# Altium schematic sheet Power.SchDoc
size 437 x 311 mm; TypeSCHEM: принципиальная; DocumentNumber1: Э3
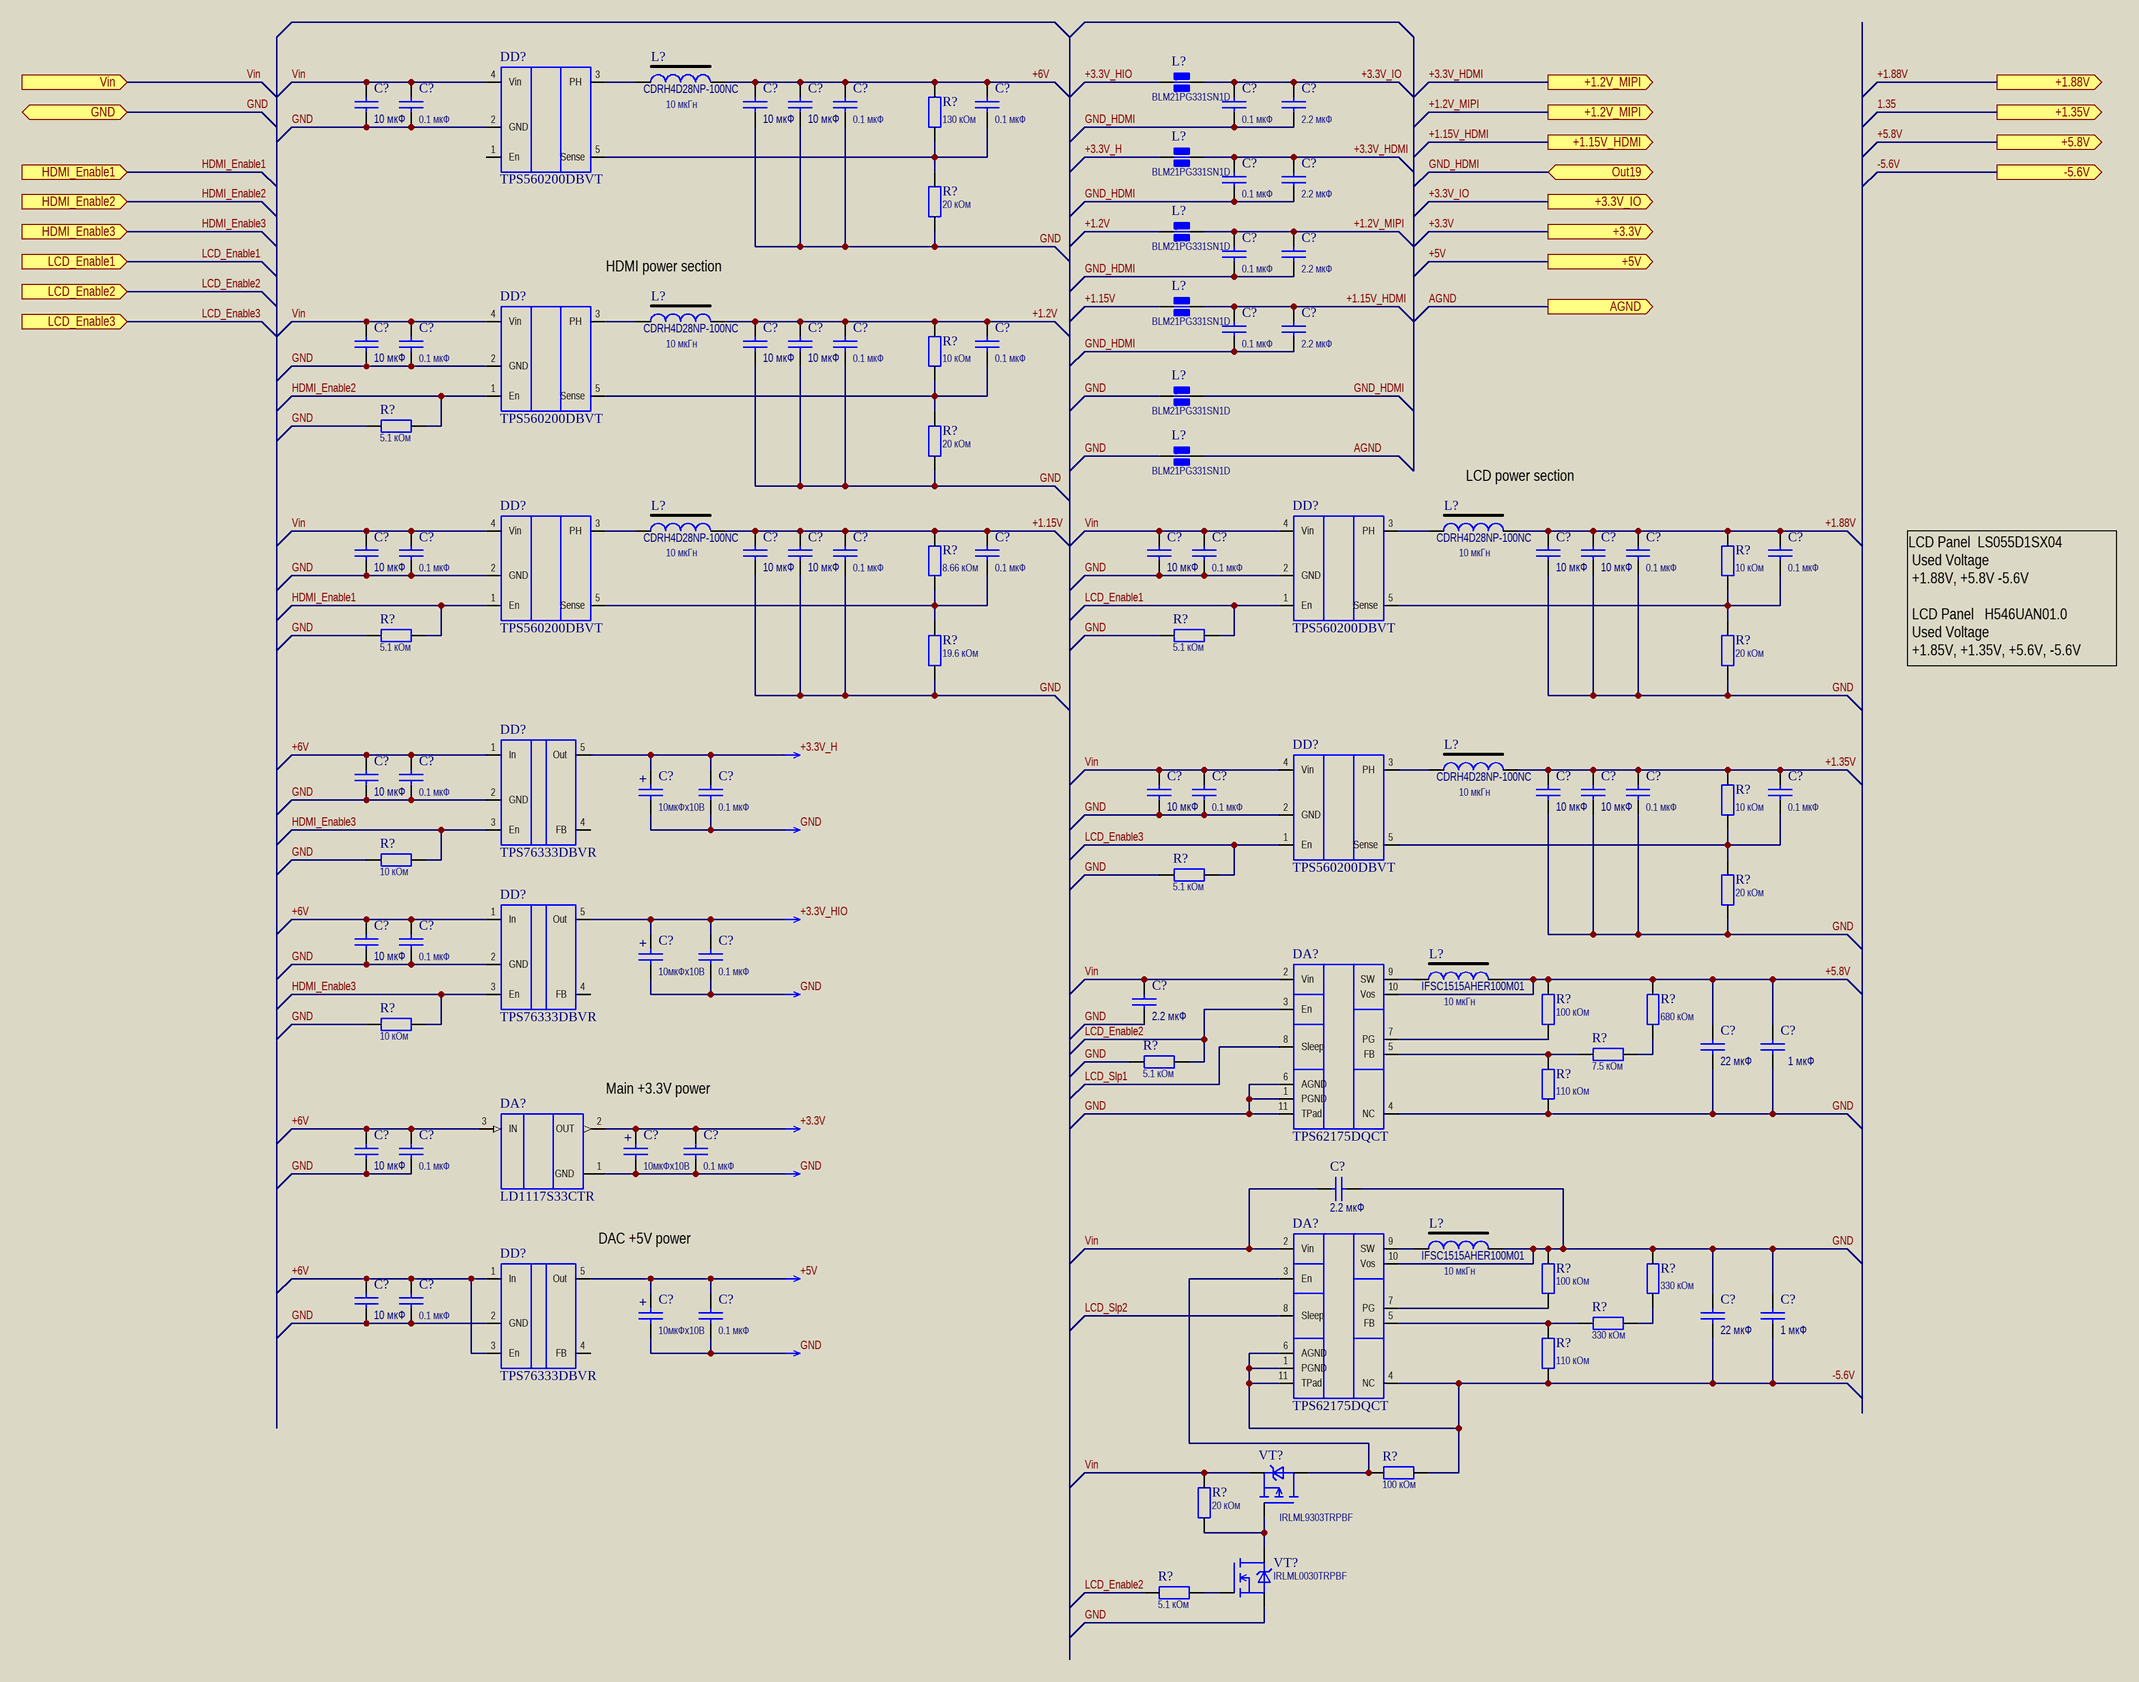
[diagram p0: Power.SchDoc]

## Parts
(Parts that share a designator on the sheet are numbered #1, #2 ... from top to bottom, then left to right.)
C?#1  10 мкФ  [Chip1210]
C?#2  value 0.1 мкФ  [Chip0603]  (hidden comment: C)
C?#3  10 мкФ  [Chip1210]
C?#4  10 мкФ  [Chip1210]
C?#5  value 0.1 мкФ  [Chip0603]  (hidden comment: C)
C?#6  value 0.1 мкФ  [Chip0603]  (hidden comment: C)
C?#7  value 0.1 мкФ  [Chip0603]  (hidden comment: C)
C?#8  value 2.2 мкФ  [Chip0603]  (hidden comment: C)
C?#9  value 0.1 мкФ  [Chip0603]  (hidden comment: C)
C?#10  value 2.2 мкФ  [Chip0603]  (hidden comment: C)
C?#11  value 0.1 мкФ  [Chip0603]  (hidden comment: C)
C?#12  value 2.2 мкФ  [Chip0603]  (hidden comment: C)
C?#13  value 0.1 мкФ  [Chip0603]  (hidden comment: C)
C?#14  value 2.2 мкФ  [Chip0603]  (hidden comment: C)
C?#15  10 мкФ  [Chip1210]
C?#16  value 0.1 мкФ  [Chip0603]  (hidden comment: C)
C?#17  10 мкФ  [Chip1210]
C?#18  10 мкФ  [Chip1210]
C?#19  value 0.1 мкФ  [Chip0603]  (hidden comment: C)
C?#20  value 0.1 мкФ  [Chip0603]  (hidden comment: C)
C?#21  10 мкФ  [Chip1210]
C?#22  value 0.1 мкФ  [Chip0603]  (hidden comment: C)
C?#23  10 мкФ  [Chip1210]
C?#24  10 мкФ  [Chip1210]
C?#25  value 0.1 мкФ  [Chip0603]  (hidden comment: C)
C?#26  value 0.1 мкФ  [Chip0603]  (hidden comment: C)
C?#27  10 мкФ  [Chip1210]
C?#28  value 0.1 мкФ  [Chip0603]  (hidden comment: C)
C?#29  10 мкФ  [Chip1210]
C?#30  10 мкФ  [Chip1210]
C?#31  value 0.1 мкФ  [Chip0603]  (hidden comment: C)
C?#32  value 0.1 мкФ  [Chip0603]  (hidden comment: C)
C?#33  10 мкФ  [Chip1210]
C?#34  value 0.1 мкФ  [Chip0603]  (hidden comment: C)
C?#35  value 10мкФx10В  [ChipA]  (hidden comment: CP)
C?#36  value 0.1 мкФ  [Chip0603]  (hidden comment: C)
C?#37  10 мкФ  [Chip1210]
C?#38  value 0.1 мкФ  [Chip0603]  (hidden comment: C)
C?#39  10 мкФ  [Chip1210]
C?#40  10 мкФ  [Chip1210]
C?#41  value 0.1 мкФ  [Chip0603]  (hidden comment: C)
C?#42  value 0.1 мкФ  [Chip0603]  (hidden comment: C)
C?#43  10 мкФ  [Chip1210]
C?#44  value 0.1 мкФ  [Chip0603]  (hidden comment: C)
C?#45  value 10мкФx10В  [ChipA]  (hidden comment: CP)
C?#46  value 0.1 мкФ  [Chip0603]  (hidden comment: C)
C?#47  2.2 мкФ  [Chip1210]
C?#48  22 мкФ  [Chip1210]
C?#49  1 мкФ  [Chip0603]
C?#50  10 мкФ  [Chip1210]
C?#51  value 0.1 мкФ  [Chip0603]  (hidden comment: C)
C?#52  value 10мкФx10В  [ChipA]  (hidden comment: CP)
C?#53  value 0.1 мкФ  [Chip0603]  (hidden comment: C)
C?#54  2.2 мкФ  [Chip1210]
C?#55  10 мкФ  [Chip1210]
C?#56  value 0.1 мкФ  [Chip0603]  (hidden comment: C)
C?#57  value 10мкФx10В  [ChipA]  (hidden comment: CP)
C?#58  value 0.1 мкФ  [Chip0603]  (hidden comment: C)
C?#59  22 мкФ  [Chip1210]
C?#60  1 мкФ  [Chip0603]
DA?#1  TPS62175DQCT  [WSON-10]
DA?#2  LD1117S33CTR  [SOT-223]
DA?#3  TPS62175DQCT  [WSON-10]
DD?#1  TPS560200DBVT  [sot23-5_s]
DD?#2  TPS560200DBVT  [sot23-5_s]
DD?#3  TPS560200DBVT  [sot23-5_s]
DD?#4  TPS560200DBVT  [sot23-5_s]
DD?#5  TPS76333DBVR  [sot23-5_s]
DD?#6  TPS560200DBVT  [sot23-5_s]
DD?#7  TPS76333DBVR  [sot23-5_s]
DD?#8  TPS76333DBVR  [sot23-5_s]
L?#1  CDRH4D28NP-100NC  value 10 мкГн  [Chip1210]
L?#2  Name: BLM21PG331SN1D  [Chip0805]  (hidden comment: Bead)
L?#3  Name: BLM21PG331SN1D  [Chip0805]  (hidden comment: Bead)
L?#4  Name: BLM21PG331SN1D  [Chip0805]  (hidden comment: Bead)
L?#5  Name: BLM21PG331SN1D  [Chip0805]  (hidden comment: Bead)
L?#6  CDRH4D28NP-100NC  value 10 мкГн  [Chip1210]
L?#7  Name: BLM21PG331SN1D  [Chip0805]  (hidden comment: Bead)
L?#8  Name: BLM21PG331SN1D  [Chip0805]  (hidden comment: Bead)
L?#9  CDRH4D28NP-100NC  value 10 мкГн  [Chip1210]
L?#10  CDRH4D28NP-100NC  value 10 мкГн  [Chip1210]
L?#11  CDRH4D28NP-100NC  value 10 мкГн  [Chip1210]
L?#12  IFSC1515AHER100M01  value 10 мкГн  [IFSC-1515AH]
L?#13  IFSC1515AHER100M01  value 10 мкГн  [IFSC-1515AH]
R?#1  130 кОм  [Res0603]
R?#2  20 кОм  [Res0603]
R?#3  10 кОм  [Res0603]
R?#4  5.1 кОм  [Res0603]
R?#5  20 кОм  [Res0603]
R?#6  8.66 кОм  [Res0603]
R?#7  10 кОм  [Res0603]
R?#8  5.1 кОм  [Res0603]
R?#9  5.1 кОм  [Res0603]
R?#10  19.6 кОм  [Res0603]
R?#11  20 кОм  [Res0603]
R?#12  10 кОм  [Res0603]
R?#13  10 кОм  [Res0603]
R?#14  5.1 кОм  [Res0603]
R?#15  20 кОм  [Res0603]
R?#16  100 кОм  [Res0603]
R?#17  680 кОм  [Res0603]
R?#18  10 кОм  [Res0603]
R?#19  7.5 кОм  [Res0603]
R?#20  5.1 кОм  [Res0603]
R?#21  110 кОм  [Res0603]
R?#22  100 кОм  [Res0603]
R?#23  330 кОм  [Res0603]
R?#24  330 кОм  [Res0603]
R?#25  110 кОм  [Res0603]
R?#26  100 кОм  [Res0603]
R?#27  20 кОм  [Res0603]
R?#28  5.1 кОм  [Res0603]
VT?#1  Name: IRLML9303TRPBF  [KT-93]  (hidden comment: MOSFET P)
VT?#2  Name: IRLML0030TRPBF  [KT-93]  (hidden comment: MOSFET N)

## Ports
+1.2V_MIPI (out), +1.15V_HDMI (out), +1.35V (out), +1.88V (out), +3.3V (out), +3.3V_IO (out), +5.8V (out), +5V (out), -5.6V (out), AGND (out), GND (bidir), HDMI_Enable1 (in), HDMI_Enable2 (in), HDMI_Enable3 (in), LCD_Enable1 (in), LCD_Enable2 (in), LCD_Enable3 (in), Out19 (bidir), Vin (in)

## Nets
+3.3V: C?#52.1 C?#53.1 DA?#2.2(OUT) DA?#2.4(Vout_tab) ; port +3.3V
1.35: port +1.35V
+1.2V: C?#17.1 C?#18.1 C?#19.1 C?#20.1 L?#4.1 L?#6.2 R?#3.2
+1.2V_MIPI: C?#9.1 C?#10.1 C?#11.1 C?#12.1 L?#3.2 L?#4.2 ; port +1.2V_MIPI  [also labelled +3.3V_HDMI]
+1.15V: C?#23.1 C?#24.1 C?#25.1 C?#26.1 L?#5.1 L?#9.2 R?#6.2
+1.15V_HDMI: C?#13.1 C?#14.1 L?#5.2 ; port +1.15V_HDMI
+1.35V: C?#39.1 C?#40.1 C?#41.1 C?#42.1 L?#11.2 R?#12.2
+1.88V: C?#29.1 C?#30.1 C?#31.1 C?#32.1 L?#10.2 R?#7.2 ; port +1.88V
+3.3V_H: C?#35.1 C?#36.1 DD?#5.5(Out) L?#3.1
+3.3V_HIO: C?#45.1 C?#46.1 DD?#7.5(Out) L?#2.1
+3.3V_IO: C?#7.1 C?#8.1 L?#2.2 ; port +3.3V_IO
+5.8V: C?#48.1 C?#49.1 DA?#1.10(Vos) L?#12.2 R?#16.1 R?#17.2 ; port +5.8V
+5V: C?#57.1 C?#58.1 DD?#8.5(Out) ; port +5V
+6V: C?#3.1 C?#4.1 C?#5.1 C?#6.1 C?#33.1 C?#34.1 C?#43.1 C?#44.1 C?#50.1 C?#51.1 C?#55.1 C?#56.1 DA?#2.3(IN) DD?#5.1(In) DD?#7.1(In) DD?#8.1(In) DD?#8.3(En) L?#1.2 R?#1.2
-5.6V: C?#59.2 C?#60.2 DA?#3.1(PGND) DA?#3.4(NC) DA?#3.6(AGND) DA?#3.11(TPad) R?#25.1 R?#26.1 ; port -5.6V
AGND: L?#8.2 ; port AGND
GND: C?#1.2 C?#2.2 C?#3.2 C?#4.2 C?#5.2 C?#15.2 C?#16.2 C?#17.2 C?#18.2 C?#19.2 C?#21.2 C?#22.2 C?#23.2 C?#24.2 C?#25.2 C?#27.2 C?#28.2 C?#29.2 C?#30.2 C?#31.2 C?#33.2 C?#34.2 C?#35.2 C?#36.2 C?#37.2 C?#38.2 C?#39.2 C?#40.2 C?#41.2 C?#43.2 C?#44.2 C?#45.2 C?#46.2 C?#47.2 C?#48.2 C?#49.2 C?#50.2 C?#51.2 C?#52.2 C?#53.2 C?#54.2 C?#55.2 C?#56.2 C?#57.2 C?#58.2 C?#59.1 C?#60.1 DA?#1.1(PGND) DA?#1.4(NC) DA?#1.6(AGND) DA?#1.11(TPad) DA?#2.1(GND) DA?#3.10(Vos) DD?#1.2(GND) DD?#2.2(GND) DD?#3.2(GND) DD?#4.2(GND) DD?#5.2(GND) DD?#6.2(GND) DD?#7.2(GND) DD?#8.2(GND) L?#7.1 L?#8.1 L?#13.2 R?#2.1 R?#4.2 R?#5.1 R?#8.2 R?#9.2 R?#10.1 R?#11.1 R?#13.2 R?#14.2 R?#15.1 R?#18.2 R?#20.1 R?#21.1 R?#22.1 R?#23.2 VT?#2.2(SOURCE) ; port GND
GND_HDMI: C?#7.2 C?#8.2 C?#9.2 C?#10.2 C?#11.2 C?#12.2 C?#13.2 C?#14.2 L?#7.2 ; port Out19
HDMI_Enable1: DD?#3.1(En) R?#8.1 ; port HDMI_Enable1
HDMI_Enable2: DD?#2.1(En) R?#4.1 ; port HDMI_Enable2
HDMI_Enable3: DD?#5.3(En) DD?#7.3(En) R?#13.1 R?#18.1 ; port HDMI_Enable3
LCD_Enable1: DD?#4.1(En) R?#9.1 ; port LCD_Enable1
LCD_Enable2: DA?#1.3(En) R?#20.2 R?#28.2 ; port LCD_Enable2
LCD_Enable3: DD?#6.1(En) R?#14.1 ; port LCD_Enable3
LCD_Slp1: DA?#1.8(Sleep)
LCD_Slp2: DA?#3.8(Sleep)
Vin: C?#1.1 C?#2.1 C?#15.1 C?#16.1 C?#21.1 C?#22.1 C?#27.1 C?#28.1 C?#37.1 C?#38.1 C?#47.1 C?#54.1 DA?#1.2(Vin) DA?#3.2(Vin) DD?#1.4(Vin) DD?#2.4(Vin) DD?#3.4(Vin) DD?#4.4(Vin) DD?#6.4(Vin) R?#27.2 VT?#1.2(SOURCE) ; port Vin
NetC?#6_2: C?#6.2 DD?#1.5(Sense) R?#1.1 R?#2.2
NetC?#20_2: C?#20.2 DD?#2.5(Sense) R?#3.1 R?#5.2
NetC?#26_2: C?#26.2 DD?#3.5(Sense) R?#6.1 R?#10.2
NetC?#32_2: C?#32.2 DD?#4.5(Sense) R?#7.1 R?#11.2
NetC?#42_2: C?#42.2 DD?#6.5(Sense) R?#12.1 R?#15.2
NetDA?#1_5: DA?#1.5(FB) R?#19.2 R?#21.2
NetDA?#1_7: DA?#1.7(PG) R?#16.2
NetDA?#1_9: DA?#1.9(SW) L?#12.1
NetDA?#3_3: DA?#3.3(En) R?#26.2 VT?#1.1(DRAIN)
NetDA?#3_5: DA?#3.5(FB) R?#24.2 R?#25.2
NetDA?#3_7: DA?#3.7(PG) R?#22.2
NetDA?#3_9: DA?#3.9(SW) L?#13.1
NetDD?#1_3: DD?#1.3(PH) L?#1.1
NetDD?#2_3: DD?#2.3(PH) L?#6.1
NetDD?#3_3: DD?#3.3(PH) L?#9.1
NetDD?#4_3: DD?#4.3(PH) L?#10.1
NetDD?#6_3: DD?#6.3(PH) L?#11.1
NetR?#17_1: R?#17.1 R?#19.1
NetR?#23_1: R?#23.1 R?#24.1
NetR?#27_1: R?#27.1 VT?#1.3(GATE) VT?#2.1(DRAIN)
NetR?#28_1: R?#28.1 VT?#2.3(GATE)

Not connected (* = marked no-connect by the designer): DD?#1 1(En); DD?#5 4(FB); DD?#7 4(FB); DD?#8 4(FB)

## Notes on the sheet
- HDMI power section
- LCD power section
- LCD Panel  LS055D1SX04
  Used Voltage
  +1.88V, +5.8V -5.6V
  LCD Panel   H546UAN01.0
  Used Voltage
  +1.85V, +1.35V, +5.6V, -5.6V
- Main +3.3V power
- DAC +5V power
- Перв. примен.
- М. экспертиза
- Справ. №
- Подп. и дата
- Инв. № дубл.
- Взам. инв. №
- Изм.
- Разраб.
- Лист.
- № докум.
- Подп.
- Дата
- Лит.
- Масса
- Масш.
- Инв. № подп.
- Пров.
- Т. контр.
- Н. контр.
- Утв.
- Схема электрическая
- принципиальная
- Лист
- Листов
- Копировал
- Формат А1
- (in symbol CP) +

## Library data of the parts
C?#1 C?#3 C?#4 C?#15 C?#17 C?#18 C?#21 C?#23 C?#24 C?#27 C?#29 C?#30 C?#33 C?#37 C?#39 C?#40 C?#43 C?#47 C?#50 C?#54 C?#55 = C: Manufacturer: Any; SubClass: General Purpose; Class: Capacitors; Name: GRM32DR61E106KA12L; Author: Harry E. Zhurov
  C?#1 C?#3 C?#4 C?#15 C?#17 C?#18 C?#21 C?#23 C?#24 C?#27 C?#29 C?#30 C?#33 C?#37 C?#39 C?#40 C?#43 C?#50 C?#55: Value: 10 мкФ
  C?#47 C?#54: Value: 2.2 мкФ
C?#2 C?#5-C?#14 C?#16 C?#19 C?#20 C?#22 C?#25 C?#26 C?#28 C?#31 C?#32 C?#34 C?#36 C?#38 C?#41 C?#42 C?#44 C?#46 C?#51 C?#53 C?#56 C?#58 = C: Manufacturer: Any; SubClass: General Purpose; Class: Capacitors; Author: Harry E. Zhurov
C?#35 C?#45 C?#52 C?#57 = CP: Manufacturer: Any; Class: Capacitors; SubClass: Polar; Name: TPSA106K010R0900; Author: Harry E. Zhurov
C?#48 C?#59 = C: Manufacturer: Any; SubClass: General Purpose; Class: Capacitors; Name: CC1206KKX5R6BB226; Author: Harry E. Zhurov; Value: 22 мкФ
C?#49 C?#60 = C: Manufacturer: Any; SubClass: General Purpose; Class: Capacitors; Name: CC0603KRX5R6BB105; Author: Harry E. Zhurov; Value: 1 мкФ
DA?#1 DA?#3 = TPS62175: 28-V, 0.5-A Step-Down Converter With Sleep Mode; Name: TPS62175DQCT
DA?#2 = REG1117: LDO; Name: LD1117S33CTR
DD?#1-DD?#4 DD?#6 = TPS560200DBVT: 4.5V to 17V Input, 500mA Synchronous Step Down SWIFT Converter  with Advanced Eco-mode; Name: TPS560200DBVT
L?#1 L?#6 L?#9-L?#11 = INDUCTANCE CORE: Manufacturer: Sumida; SubClass: With Core; Class: Inductance; Author: Harry E. Zhurov; Name: CDRH4D28NP-100NC
L?#2-L?#5 L?#7 L?#8 = Bead: Manufacturer: Any; SubClass: General Purpose; Class: Capacitors; Author: Harry E. Zhurov
L?#12 L?#13 = INDUCTANCE CORE: Manufacturer: Vishay; SubClass: With Core; Class: Inductance; Author: Harry E. Zhurov; Name: IFSC1515AHER100M01
R?#1-R?#15 R?#18 R?#20 R?#26-R?#28 = R: Manufacturer: Any; Class: Resistor; SubClass: Constant
  R?#1: Value: 130 кОм
  R?#2 R?#5 R?#11 R?#15 R?#27: Value: 20 кОм
  R?#3 R?#7 R?#12 R?#13 R?#18: Value: 10 кОм
  R?#4 R?#8 R?#9 R?#14 R?#20 R?#28: Value: 5.1 кОм
  R?#6: Value: 8.66 кОм
  R?#10: Value: 19.6 кОм
  R?#26: Value: 100 кОм
R?#16 R?#22 = R: Manufacturer: Any; Class: Resistor; SubClass: Constant; Name: RC0603FR-07100KL; Value: 100 кОм
R?#17 = R: Manufacturer: Any; Class: Resistor; SubClass: Constant; Name: RC0603FR-07680KL; Value: 680 кОм
R?#19 = R: Manufacturer: Any; Class: Resistor; SubClass: Constant; Name: RC0603FR-077K5L; Value: 7.5 кОм
R?#21 R?#25 = R: Manufacturer: Any; Class: Resistor; SubClass: Constant; Name: RC0603FR-07110KL; Value: 110 кОм
R?#23 R?#24 = R: Manufacturer: Any; Class: Resistor; SubClass: Constant; Name: RC0603JR-07330KL; Value: 330 кОм
VT?#1 = MOSFET P: Manufacturer: Ангстрем; Class: Transistors; SubClass: P-MOSFET; Author: Harry E. Zhurov
VT?#2 = MOSFET N: Manufacturer: ВЗЗП-С; Class: Transistors; SubClass: N-MOSFET; Author: Harry E. Zhurov
DD?#5 DD?#7 DD?#8 = TPS76333DBVR: Name: TPS76333DBVR